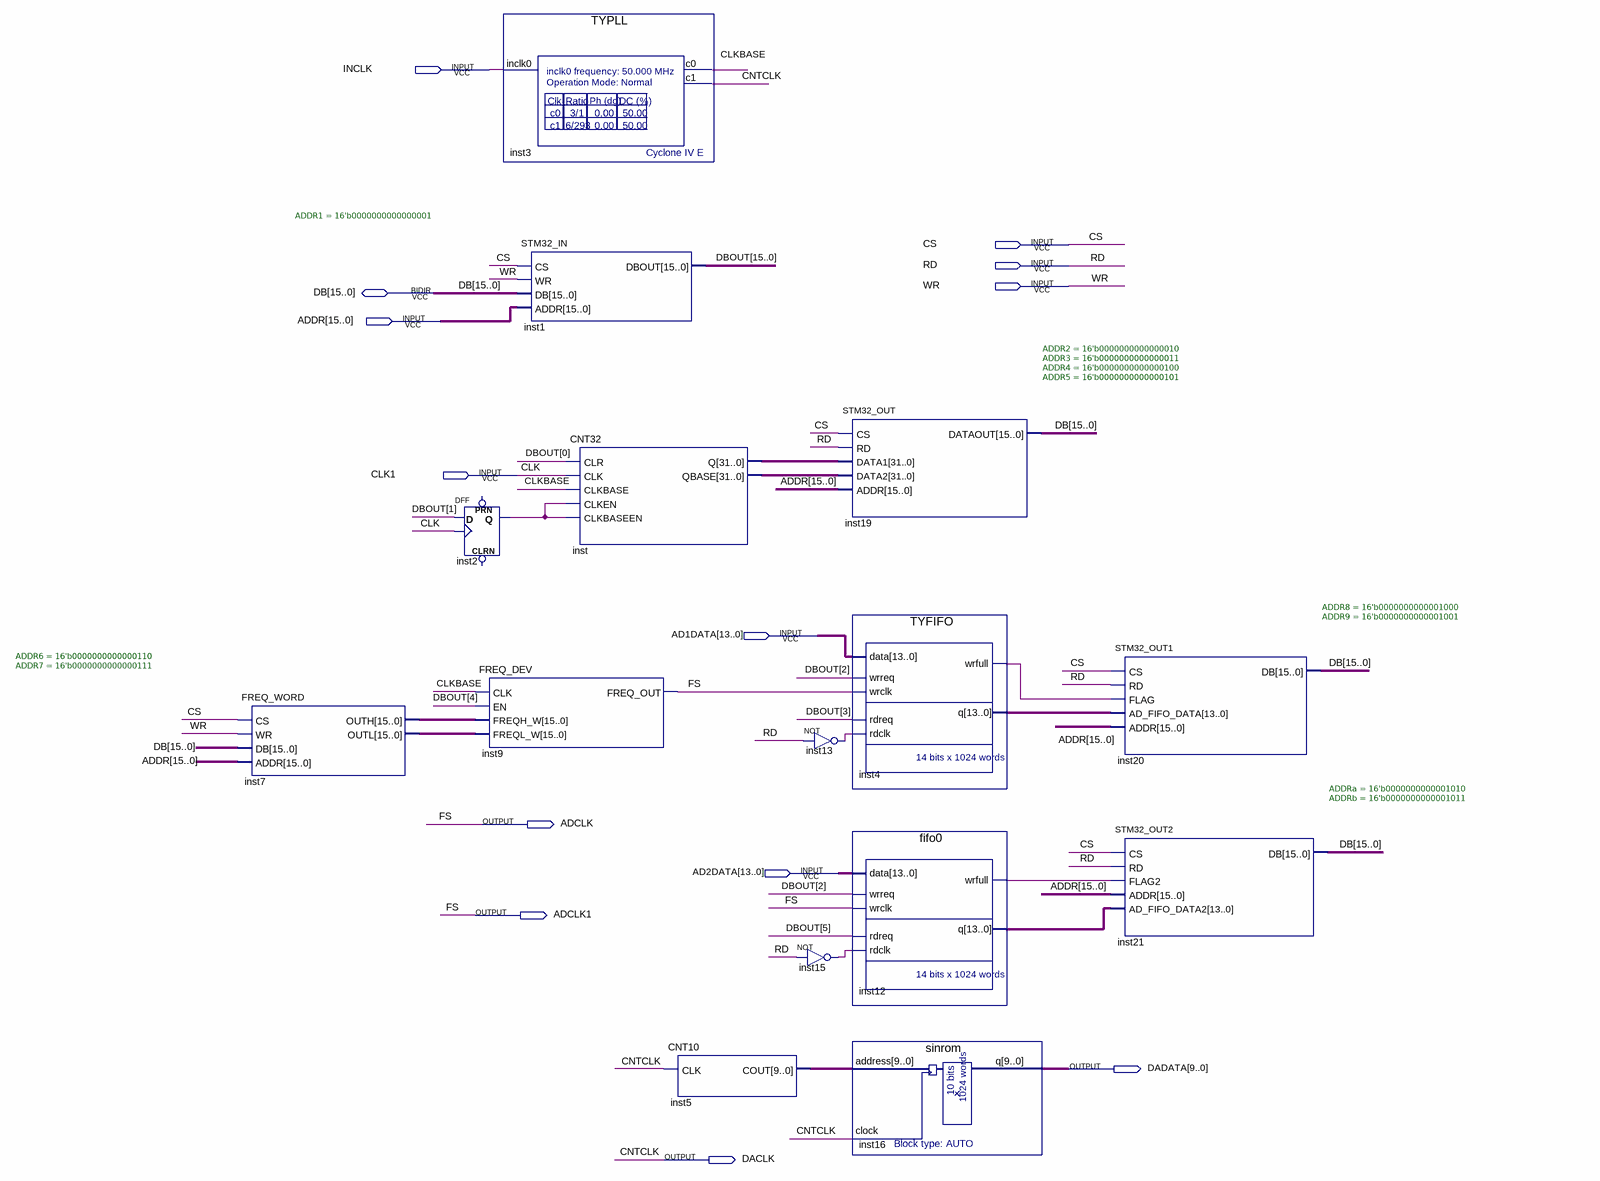
[diagram p0: schematic sheet]
// Quartus schematic TOP.bdf as structural Verilog: 15 symbols, 13 pins
module TOP (
  input  INCLK,
  input  CS,
  input  RD,
  input  WR,
  input  [15:0] ADDR,
  input  CLK1,
  input  [13:0] AD1DATA,
  input  [13:0] AD2DATA,
  inout  [15:0] DB,
  output ADCLK,
  output ADCLK1,
  output [9:0] DADATA,
  output DACLK
);

  wire CLKBASE, inst2_q, inst4_wrfull, inst12_wrfull, inst13_out, inst15_out;
  wire [9:0] inst5_cout;
  wire [13:0] inst4_q, inst12_q;
  wire [15:0] DBOUT, inst7_outh, inst7_outl;
  wire [31:0] inst_q, inst_qbase;

  FREQ_WORD #(.ADDR6(16'b0000000000000110), .ADDR7(16'b0000000000000111)) inst7 (
    .CS(CS), .WR(WR), .DB(DB), .ADDR(ADDR), .OUTH(inst7_outh), .OUTL(inst7_outl));
  DFF inst2 (.CLK(CLK1), .D(DBOUT[1]), .Q(inst2_q));  // open: CLRN, PRN
  FREQ_DEV inst9 (.CLK(CLKBASE), .EN(DBOUT[4]), .FREQH_W(inst7_outh), .FREQL_W(inst7_outl), .FREQ_OUT(ADCLK));
  TYPLL inst3 (.inclk0(INCLK), .c0(CLKBASE), .c1(DACLK));
  STM32_IN #(.ADDR1(16'b0000000000000001)) inst1 (.CS(CS), .WR(WR), .DB(DB), .ADDR(ADDR), .DBOUT(DBOUT));
  CNT32 inst (
    .CLR(DBOUT[0]), .CLK(CLK1), .CLKBASE(CLKBASE), .CLKEN(inst2_q), .CLKBASEEN(inst2_q), .Q(inst_q),
    .QBASE(inst_qbase));
  CNT10 inst5 (.CLK(DACLK), .COUT(inst5_cout));
  not inst13 (inst13_out, RD);
  not inst15 (inst15_out, RD);
  STM32_OUT #(.ADDR2(16'b0000000000000010), .ADDR3(16'b0000000000000011), .ADDR4(16'b0000000000000100), .ADDR5(16'b0000000000000101)) inst19 (
    .CS(CS), .RD(RD), .DATA1(inst_q), .DATA2(inst_qbase), .ADDR(ADDR), .DATAOUT(DB));
  TYFIFO inst4 (
    .data(AD1DATA), .wrreq(DBOUT[2]), .wrclk(ADCLK), .rdreq(DBOUT[3]), .rdclk(inst13_out),
    .wrfull(inst4_wrfull), .q(inst4_q));
  fifo0 inst12 (
    .data(AD2DATA), .wrreq(DBOUT[2]), .wrclk(ADCLK), .rdreq(DBOUT[5]), .rdclk(inst15_out),
    .wrfull(inst12_wrfull), .q(inst12_q));
  sinrom inst16 (.address(inst5_cout), .clock(DACLK), .q(DADATA));
  STM32_OUT1 #(.ADDR8(16'b0000000000001000), .ADDR9(16'b0000000000001001)) inst20 (
    .CS(CS), .RD(RD), .FLAG(inst4_wrfull), .AD_FIFO_DATA(inst4_q), .ADDR(ADDR), .DB(DB));
  STM32_OUT2 #(.ADDRa(16'b0000000000001010), .ADDRb(16'b0000000000001011)) inst21 (
    .CS(CS), .RD(RD), .FLAG2(inst12_wrfull), .ADDR(ADDR), .AD_FIFO_DATA2(inst12_q), .DB(DB));

  assign ADCLK1 = ADCLK;

  // Other names for the same wires on the sheet: CLK = CLK1; CNTCLK = DACLK; FS = ADCLK
endmodule
